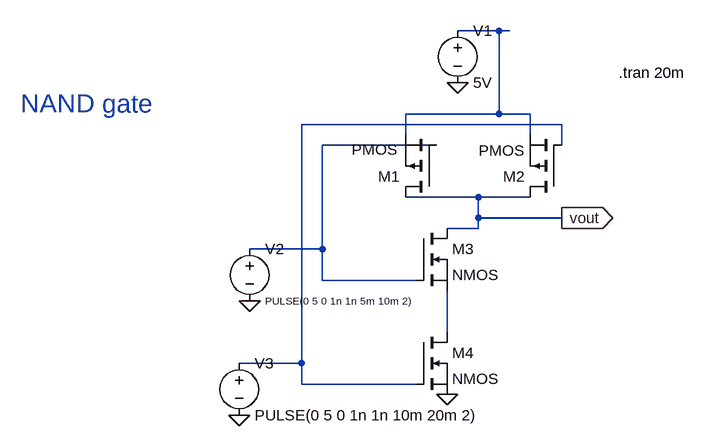
[diagram p0: schematic CMOS_NAND.asc]
CMOS_NAND.asc, the LTspice schematic file:
Version 4
SHEET 1 880 680
WIRE 192 -64 128 -64
WIRE 208 -64 192 -64
WIRE 192 64 192 -64
WIRE 192 64 48 64
WIRE 240 64 192 64
WIRE 288 80 -112 80
WIRE 48 96 48 64
WIRE 240 96 240 64
WIRE 96 112 -80 112
WIRE 288 112 288 80
WIRE 160 192 48 192
WIRE 240 192 160 192
WIRE 160 224 160 192
WIRE 288 224 160 224
WIRE 160 240 160 224
WIRE 160 240 112 240
WIRE -80 272 -80 112
WIRE -80 272 -192 272
WIRE -80 320 -80 272
WIRE 64 320 -80 320
WIRE 112 400 112 336
WIRE -112 448 -112 80
WIRE -112 448 -208 448
WIRE -112 480 -112 448
WIRE 64 480 -112 480
FLAG 112 496 0
FLAG -192 352 0
FLAG -208 528 0
FLAG 288 224 vout
IOPIN 288 224 Out
FLAG 128 16 0
SYMBOL pmos 288 192 R180
WINDOW 3 57 72 Left 2
SYMATTR InstName M2
SYMBOL nmos 64 240 R0
SYMATTR InstName M3
SYMBOL nmos 64 400 R0
SYMATTR InstName M4
SYMBOL voltage -192 256 R0
WINDOW 3 24 96 Left 1
WINDOW 123 0 0 Left 0
WINDOW 39 0 0 Left 0
SYMATTR Value PULSE(0 5 0 1n 1n 5m 10m 2)
SYMATTR InstName V2
SYMBOL voltage -208 432 R0
WINDOW 123 0 0 Left 0
WINDOW 39 0 0 Left 0
SYMATTR InstName V3
SYMATTR Value PULSE(0 5 0 1n 1n 10m 20m 2)
SYMBOL pmos 96 192 R180
WINDOW 3 60 73 Left 2
SYMATTR InstName M1
SYMBOL voltage 128 -80 R0
WINDOW 123 0 0 Left 0
WINDOW 39 0 0 Left 0
SYMATTR InstName V1
SYMATTR Value 5V
TEXT -544 48 Left 4 ;NAND gate
TEXT 376 0 Left 2 !.tran 20m

The netlist it stands for:
* CMOS_NAND.asc
M2 vout N002 N001 N001 PMOS
M3 vout N003 N004 N004 NMOS
M4 N004 N002 0 0 NMOS
V2 N003 0 PULSE(0 5 0 1n 1n 5m 10m 2)
V3 N002 0 PULSE(0 5 0 1n 1n 10m 20m 2)
M1 vout N003 N001 N001 PMOS
V1 N001 0 5V
.model NMOS NMOS
.model PMOS PMOS
.lib standard.mos
* NAND gate
.tran 20m
.backanno
.end